# Altium schematic sheet nRF 52840.SchDoc
size A; DocumentNumber: 1; SheetNumber: 1; SheetTotal: 3
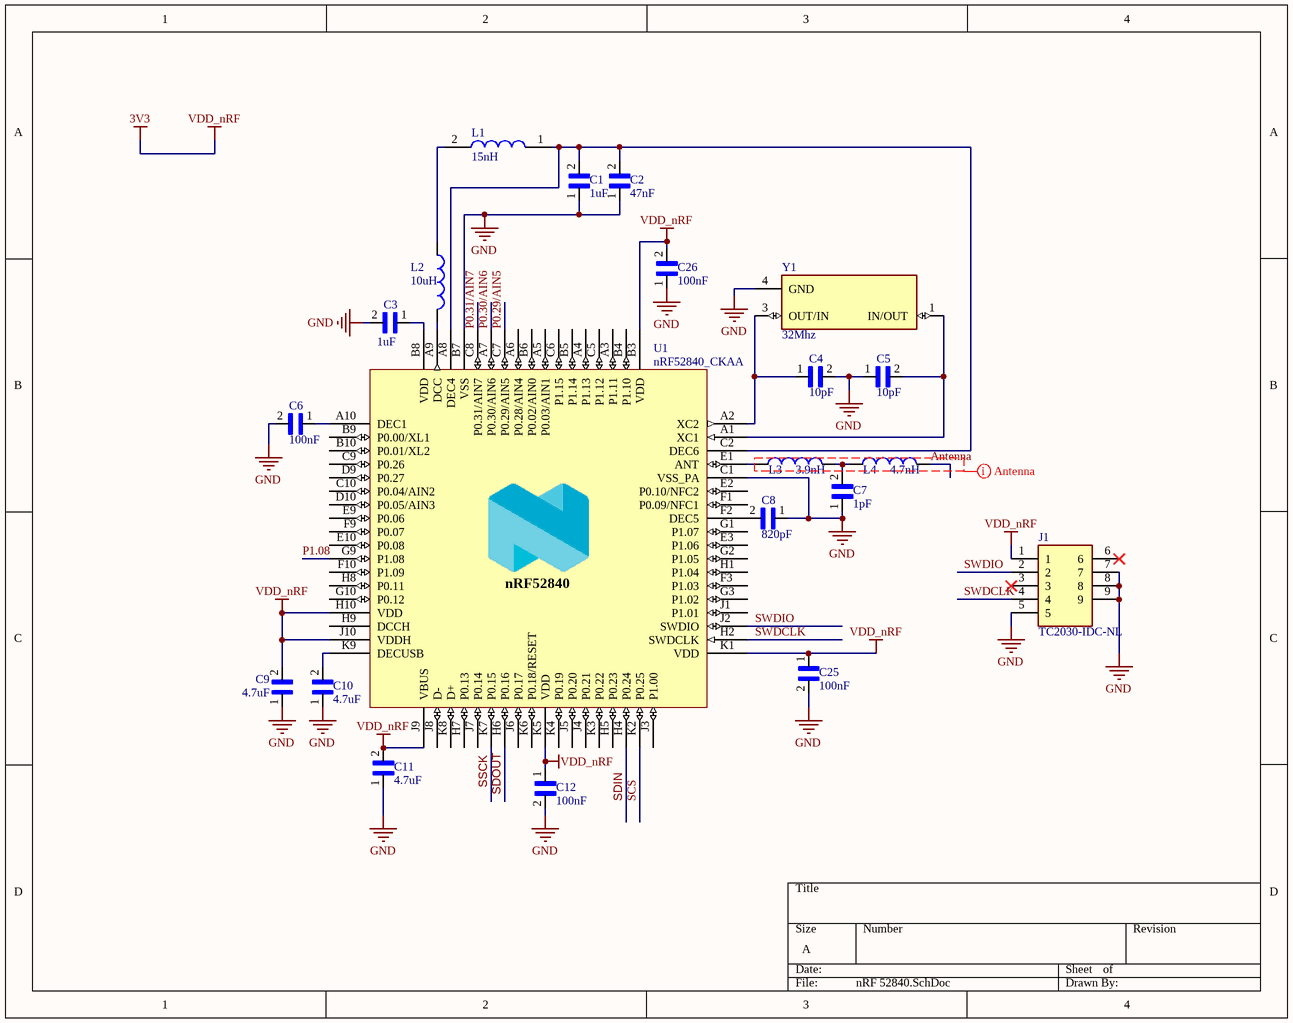
[diagram p0: nRF 52840.SchDoc]

## Parts
C1  1uF  [CAPC1608X90N]
C2  47nF  [CAPC0603X33N]
C3  1uF  [CAPC1608X90N]
C4  10pF  [CAPC0603X33N]
C5  10pF  [CAPC0603X33N]
C6  100nF  [CAPC1608X90N]
C7  1pF  [CAPC0603X33N]
C8  820pF  [CAPC0603X33N]
C9  4.7uF  [CAPC1608X95N]
C10  4.7uF  [CAPC1608X95N]
C11  4.7uF  [CAPC1608X95N]
C12  100nF  [CAPC1005X55N]
C25  100nF  [CAPC1005X55N]
C26  100nF  [CAPC1005X55N]
J1  TC2030-IDC-NL  [TC2030IDCNL]  (no BOM)
L1  15nH  [LQG15WH0N7B02D]
L2  10uH  [INDC1608X100N]
L3  3.9nH  [INDC0603X33N]
L4  4.7nH  [INDC0603X33N]
U1  nRF52840_CKAA  [BGA94C35P10X10_352X356X50]
Y1  32Mhz  [XTAL_ECS-374-8-48-CKY-TR]

## Nets
3V3: C9.2 C11.2 C12.1 C25.1 C26.2 J1.1 U1.B3(VDD) U1.H10(VDD) U1.J9(VBUS) U1.J10(VDDH) U1.K1(VDD) U1.K5(VDD)  [also labelled VDD_nRF]
GND: C1.1 C2.1 C3.2 C4.2 C5.1 C6.2 C7.1 C8.1 C9.1 C10.1 C11.1 C12.2 C25.2 C26.1 J1.5 J1.7 J1.8 J1.9 U1.B7(VSS) U1.C1(VSS_PA) U1.C4(GND) U1.D3(GND) U1.D4(GND) U1.D5(GND) U1.D6(GND) U1.D7(GND) U1.D8(GND) U1.E4(GND) U1.E5(GND) U1.E6(GND) U1.E7(GND) U1.E8(GND) U1.F4(GND) U1.F5(GND) U1.F6(GND) U1.F7(GND) U1.F8(GND) U1.G4(GND) U1.G5(GND) U1.G6(GND) U1.G7(GND) U1.G8(GND) U1.K10(GND) Y1.4(GND)
Antenna: L4.2
P0.29/AIN5: U1.C7(P0.29/AIN5)
P0.30/AIN6: U1.A7(P0.30/AIN6)
P0.31/AIN7: U1.C8(P0.31/AIN7)
P1.08: U1.G9(P1.08)
SCS: U1.K2(P0.25)
SDIN: U1.H4(P0.24)
SDOUT: U1.H6(P0.16)
SSCK: U1.K7(P0.15)
SWDCLK: J1.4 U1.H2(SWDCLK)
SWDIO: J1.2 U1.J2(SWDIO)
NetC1_2: C1.2 C2.2 L1.1 U1.A8(DEC4) U1.C2(DEC6)
NetC3_1: C3.1 U1.B8(VDD)
NetC4_1: C4.1 U1.A2(XC2) Y1.3(OUT/IN)
NetC5_2: C5.2 U1.A1(XC1) Y1.1(IN/OUT)
NetC6_1: C6.1 U1.A10(DEC1)
NetC7_2: C7.2 L3.2 L4.1
NetC8_2: C8.2 U1.F2(DEC5)
NetC10_2: C10.2 U1.K9(DECUSB)
NetL1_2: L1.2 L2.1
NetL2_2: L2.2 U1.A9(DCC)
NetL3_1: L3.1 U1.E1(ANT)

Not connected (* = marked no-connect by the designer): J1 3* 6*; U1 A3(P1.11) A4(P1.13) A5(P0.03/AIN1) A6(P0.28/AIN4) B4(P1.10) B5(P1.14) B6(P0.02/AIN0) B9(P0.00/XL1) B10(P0.01/XL2) C5(P1.12) C6(P1.15) C9(P0.26) C10(P0.04/AIN2) D9(P0.27) D10(P0.05/AIN3) E2(P0.10/NFC2) E3(P1.06) E9(P0.06) E10(P0.08) F1(P0.09/NFC1) F3(P1.03) F9(P0.07) F10(P1.09) G1(P1.07) G2(P1.05) G3(P1.02) G10(P0.12) H1(P1.04) H5(P0.23) H7(P0.13) H8(P0.11) H9(DCCH) J1(P1.01) J3(P1.00) J4(P0.21) J5(P0.20) J6(P0.17) J7(P0.14) J8(D-) K3(P0.22) K4(P0.19) K6(P0.18/RESET) K8(D+)

## Layout directives
net class 2.4GhZ RF: Antenna

## Notes on the sheet
- (in symbol nRF52840_CKAA) nRF52840

## Library data of the parts
C1 C3 = C1608X7R1C105K080AC: TDK - C1608X7R1C105K080AC - SMD Multilayer Ceramic Capacitor, 1 µF, 16 V, 0603 [1608 Metric], ± 10%, X7R, C Series TDK; Voltage Rating: 16V; Supplier 1: Digi-Key; Manufacturer: TDK; Manufacturer Part Number: C1608X7R1C105K080AC; RoHS: Yes; Category: Ceramic Capacitors; Stock 1: 2663219; Pricing 1: 1=0.13000, 10=0.09600, 50=0.05440, 100=0.04500, 500=0.03156, 1000=0.02613 (USD); Mount: Surface Mount; Case/Package: 0603; Case Code (Metric): 1608; Case Code (Imperial): 0603; Dielectric Material: Ceramic; Weight: 7.1E-05oz; Min Operating Temperature: -55°C; Max Operating Temperature: 125°C; Capacitance: 1uF; Tolerance: 10%; Dielectric: X7R; Packaging: Tape and Reel; Package Quantity: 1; Voltage Rating (DC): 16V; Termination: SMD/SMT; Voltage: 16V; Series: C; Construction: Flat; Resistor Type: Ceramic; Length: 1.6mm; Width: 0.031inch; Height: 0.8mm; Depth: 0.8mm; Thickness: 0.037inch; Radiation Hardening: No; REACH SVHC: No SVHC; Lead Free: Lead Free; RoHS Compliant: Yes; ComponentLink1URL: https://datasheet.ciiva.com/11788/0900766b80c1bb00-11788075.pdf?src-supplier=RSComponents; ComponentLink1Description: https://datasheet.ciiva.com/11788/0900766b80c1bb00-11788075.pdf?src-supplier=RSComponents; ComponentLink2URL: https://datasheet.ciiva.com/22648/1796654-22648704.pdf?src-supplier=Element14; ComponentLink2Description: https://datasheet.ciiva.com/22648/1796654-22648704.pdf?src-supplier=Element14; ComponentLink3URL: https://datasheet.ciiva.com/26285/3025c1608x7r1c105k080ac-26285242.pdf?src-supplier=Onlinecomponents.com; ComponentLink3Description: https://datasheet.ciiva.com/26285/3025c1608x7r1c105k080ac-26285242.pdf?src-supplier=Onlinecomponents.com; ComponentLink4URL: https://datasheet.ciiva.com/15192/getdatasheetpartid-715881-15192029.pdf?src-supplier=Verical; ComponentLink4Description: https://datasheet.ciiva.com/15192/getdatasheetpartid-715881-15192029.pdf?src-supplier=Verical; ComponentLink5URL: https://datasheet.ciiva.com/17487/e412-c-17487343.pdf?src-supplier=Avnet+Europe; ComponentLink5Description: https://datasheet.ciiva.com/17487/e412-c-17487343.pdf?src-supplier=Avnet+Europe; ComponentLink6URL: https://datasheet.ciiva.com/22694/1796654-22694127.pdf?src-supplier=Element14; ComponentLink6Description: https://datasheet.ciiva.com/22694/1796654-22694127.pdf?src-supplier=Element14; ComponentLink7URL: https://datasheet.ciiva.com/6250/tdkmlcccaprange-6250871.pdf?src-supplier=Digi-Key; ComponentLink7Description: https://datasheet.ciiva.com/6250/tdkmlcccaprange-6250871.pdf?src-supplier=Digi-Key; ComponentLink8URL: https://datasheet.ciiva.com/16199/e412-c-16199815.pdf?src-supplier=Future+Electronics; ComponentLink8Description: https://datasheet.ciiva.com/16199/e412-c-16199815.pdf?src-supplier=Future+Electronics; ComponentLink9URL: https://datasheet.ciiva.com/6156/1571323-6156168.pdf?src-supplier=Farnell; ComponentLink9Description: https://datasheet.ciiva.com/6156/1571323-6156168.pdf?src-supplier=Farnell; ComponentLink10URL: https://datasheet.ciiva.com/48671/e412-c-48671305.pdf?src-supplier=Avnet; ComponentLink10Description: https://datasheet.ciiva.com/48671/e412-c-48671305.pdf?src-supplier=Avnet; ComponentLink11URL: https://datasheet.ciiva.com/22749/1744655-22749595.pdf?src-supplier=Element14; ComponentLink11Description: https://datasheet.ciiva.com/22749/1744655-22749595.pdf?src-supplier=Element14
C2 = GRM033R61C473KE84D: 0201 47 nF 16 V ±10% Tolerance X5R SMT Multilayer Ceramic Capacitor; Manufacturer: Murata; Voltage Rating: 16V; Supplier 1: Digi-Key; Manufacturer Part Number: GRM033R61C473KE84D; RoHS: Yes; Category: Ceramic Capacitors; Stock 1: 123710; Pricing 1: 1=0.10000, 10=0.06800, 50=0.03720, 100=0.03040, 500=0.02174, 1000=0.01708, 2500=0.01552, 5000=0.01428 (USD); Mount: Surface Mount; Case/Package: 0201; Case Code (Metric): 0603; Case Code (Imperial): 0201; Weight: 1.2E-05oz; Min Operating Temperature: -55°C; Max Operating Temperature: 85°C; Package Quantity: 15000; Packaging: Tape and Reel; Capacitance: 47nF; Tolerance: 10%; Voltage Rating (DC): 16V; Dielectric: X5R; Termination: SMD/SMT; Length: 0.024inch; Width: 0.012inch; Height: 0.3mm; Thickness: 0.013inch; Lead Free: Lead Free; RoHS Compliant: Yes; ComponentLink1URL: https://datasheet.ciiva.com/18699/grm033r61c473ke84-01-18699268.pdf?src-supplier=Digi-Key; ComponentLink1Description: https://datasheet.ciiva.com/18699/grm033r61c473ke84-01-18699268.pdf?src-supplier=Digi-Key; ComponentLink2URL: https://datasheet.ciiva.com/18699/partnumbering-e-01-18699269.pdf?src-supplier=Digi-Key; ComponentLink2Description: https://datasheet.ciiva.com/18699/partnumbering-e-01-18699269.pdf?src-supplier=Digi-Key; ComponentLink3URL: https://datasheet.ciiva.com/24221/c02e-24221301.pdf?src-supplier=Mouser; ComponentLink3Description: https://datasheet.ciiva.com/24221/c02e-24221301.pdf?src-supplier=Mouser; ComponentLink4URL: https://datasheet.ciiva.com/18699/partnumbering-e-01-18699270.pdf?src-supplier=Digi-Key; ComponentLink4Description: https://datasheet.ciiva.com/18699/partnumbering-e-01-18699270.pdf?src-supplier=Digi-Key
C4 C5 = GRM0335C2A100JA01D: Cap Ceramic 10pF 100V C0G 5% Pad SMD 0201 125C T/R; Manufacturer: Murata; Supplier 1: Digi-Key; Manufacturer Part Number: GRM0335C2A100JA01D; RoHS: Yes; Category: Ceramic Capacitors; Stock 1: 52350; Pricing 1: 1=0.10000, 10=0.03200, 50=0.01720, 100=0.01410, 500=0.01006, 1000=0.00791, 2500=0.00719, 5000=0.00661 (USD); Mount: Surface Mount; Case/Package: 0201; Case Code (Metric): 0603; Case Code (Imperial): 0201; Weight: 1.2E-05oz; Min Operating Temperature: -55°C; Max Operating Temperature: 125°C; Package Quantity: 1; Packaging: Tape and Reel; Capacitance: 10pF; Tolerance: 5%; Voltage Rating: 100V; Voltage Rating (DC): 100V; Dielectric: C0G; Termination: SMD/SMT; Length: 0.024inch; Width: 0.012inch; Height: 0.3mm; Thickness: 0.013inch; RoHS Compliant: Yes; ComponentLink1URL: https://datasheet.ciiva.com/18699/partnumbering-e-01-18699375.pdf?src-supplier=Digi-Key; ComponentLink1Description: https://datasheet.ciiva.com/18699/partnumbering-e-01-18699375.pdf?src-supplier=Digi-Key; ComponentLink2URL: https://datasheet.ciiva.com/18699/partnumbering-e-01-18699374.pdf?src-supplier=Digi-Key; ComponentLink2Description: https://datasheet.ciiva.com/18699/partnumbering-e-01-18699374.pdf?src-supplier=Digi-Key; ComponentLink3URL: https://datasheet.ciiva.com/24221/c02e-24221150.pdf?src-supplier=Mouser; ComponentLink3Description: https://datasheet.ciiva.com/24221/c02e-24221150.pdf?src-supplier=Mouser
C6 = 06033G104ZAT2A: 0603 100 nF 25 V -20 / +80 % Tolerance Y5V SMT Multilayer Ceramic Capacitor; Manufacturer: Kyocera AVX; Tolerance: 80%; Voltage Rating (DC): 25V; Insulation Resistance: 100GR; Dissipation Factor: 7%; Supplier 1: Digi-Key; Manufacturer Part Number: 06033G104ZAT2A; RoHS: Yes; Category: Ceramic Capacitors; Stock 1: 1016354; Pricing 1: 1=0.10000, 10=0.03000, 50=0.01660, 100=0.01350, 500=0.00966, 1000=0.00759 (USD); Mount: Surface Mount,PCB; Case/Package: 0603; Number of Pins: 2; Case Code (Imperial): 0603; Case Code (Metric): 1608; Contact Plating: Tin,Matte; Case Code: 0603; Min Operating Temperature: -30°C; Max Operating Temperature: 85°C; Capacitance: 100nF; Dielectric: Y5V; Packaging: Tape and Reel; Package Quantity: 1; Termination: SMD/SMT; Voltage Rating: 25V; Voltage: 25V; Series: -; Construction: Flat; Length: 1.6mm; Width: 0.032inch; Height: 0.9mm; Thickness: 0.035inch; Depth: 0.81mm; Radiation Hardening: No; REACH SVHC: No SVHC; Lead Free: Lead Free; RoHS Compliant: Yes; ComponentLink1URL: https://datasheet.ciiva.com/1124/318409-1124608.pdf?src-supplier=Element14; ComponentLink1Description: https://datasheet.ciiva.com/1124/318409-1124608.pdf?src-supplier=Element14; ComponentLink2URL: https://datasheet.ciiva.com/11786/0900766b802d4699-11786267.pdf?src-supplier=RSComponents; ComponentLink2Description: https://datasheet.ciiva.com/11786/0900766b802d4699-11786267.pdf?src-supplier=RSComponents; ComponentLink3URL: https://datasheet.ciiva.com/2987/cy5v-2987766.pdf?src-supplier=Avnet; ComponentLink3Description: https://datasheet.ciiva.com/2987/cy5v-2987766.pdf?src-supplier=Avnet; ComponentLink4URL: https://datasheet.ciiva.com/11464/cy5v-11464567.pdf?src-supplier=Avnet; ComponentLink4Description: https://datasheet.ciiva.com/11464/cy5v-11464567.pdf?src-supplier=Avnet; ComponentLink5URL: https://datasheet.ciiva.com/16484/cy5v-16484423.pdf?src-supplier=Avnet+Asia; ComponentLink5Description: https://datasheet.ciiva.com/16484/cy5v-16484423.pdf?src-supplier=Avnet+Asia; ComponentLink6URL: https://datasheet.ciiva.com/14590/70001073-14590664.pdf?src-supplier=Allied+Electronics; ComponentLink6Description: https://datasheet.ciiva.com/14590/70001073-14590664.pdf?src-supplier=Allied+Electronics; ComponentLink7URL: https://datasheet.ciiva.com/203/cy5v-203689.pdf?src-supplier=Digi-Key; ComponentLink7Description: https://datasheet.ciiva.com/203/cy5v-203689.pdf?src-supplier=Digi-Key; ComponentLink8URL: https://datasheet.ciiva.com/203/cy5v-203690.pdf?src-supplier=Digi-Key; ComponentLink8Description: https://datasheet.ciiva.com/203/cy5v-203690.pdf?src-supplier=Digi-Key; ComponentLink9URL: https://datasheet.ciiva.com/203/cy5v-203691.pdf?src-supplier=Digi-Key; ComponentLink9Description: https://datasheet.ciiva.com/203/cy5v-203691.pdf?src-supplier=Digi-Key; ComponentLink10URL: https://datasheet.ciiva.com/28613/578190-28613276.pdf?src-supplier=Element14; ComponentLink10Description: https://datasheet.ciiva.com/28613/578190-28613276.pdf?src-supplier=Element14; ComponentLink11URL: https://datasheet.ciiva.com/1124/578190-1124654.pdf?src-supplier=Element14; ComponentLink11Description: https://datasheet.ciiva.com/1124/578190-1124654.pdf?src-supplier=Element14; ComponentLink12URL: https://datasheet.ciiva.com/1124/578190-1124655.pdf?src-supplier=Element14; ComponentLink12Description: https://datasheet.ciiva.com/1124/578190-1124655.pdf?src-supplier=Element14
C7 = GRM0335C1H1R0BA01D: 0201 1 pF 50 V ±0.1 pF Tolerance C0G SMT Multilayer Ceramic Capacitor; Manufacturer: Murata; Voltage Rating: 50V; Supplier 1: Digi-Key; Manufacturer Part Number: GRM0335C1H1R0BA01D; RoHS: Yes; Category: Ceramic Capacitors; Stock 1: 1332849; Pricing 1: 1=0.10000, 10=0.02000, 50=0.01100, 100=0.00900, 500=0.00644, 1000=0.00506, 2500=0.00460, 5000=0.00423 (USD); Mount: Surface Mount; Case/Package: 0201; Case Code (Metric): 0603; Case Code (Imperial): 0201; Min Operating Temperature: -55°C; Max Operating Temperature: 125°C; Packaging: Tape and Reel; Package Quantity: 15000; Capacitance: 1pF; Dielectric: C0G; Termination: SMD/SMT; Voltage Rating (DC): 50V; Series: GRM; Length: 0.024inch; Width: 0.012inch; Thickness: 0.013inch; Depth: 0.3mm; Lead Free: Lead Free; RoHS Compliant: Yes; ComponentLink1URL: https://datasheet.ciiva.com/29538/partnumbering-e-01-29538566.pdf?src-supplier=Digi-Key; ComponentLink1Description: https://datasheet.ciiva.com/29538/partnumbering-e-01-29538566.pdf?src-supplier=Digi-Key
C8 = GRM033R71E821KA01D: 0201 820 pF 25 V ±10% Tolerance X7R Multilayer Ceramic Capacitor; Manufacturer: Murata; Voltage Rating: 25V; Supplier 1: Digi-Key; Manufacturer Part Number: GRM033R71E821KA01D; RoHS: Yes; Category: Ceramic Capacitors; Stock 1: 127531; Pricing 1: 1=0.10000, 10=0.02700, 50=0.01440, 100=0.01180, 500=0.00846, 1000=0.00664, 2500=0.00604, 5000=0.00555 (USD); Mount: Surface Mount; Case/Package: 0201; Case Code (Imperial): 0201; Case Code (Metric): 0603; Min Operating Temperature: -55°C; Max Operating Temperature: 125°C; Capacitance: 820pF; Tolerance: 10%; Dielectric: X7R; Packaging: Tape and Reel; Package Quantity: 1; Voltage Rating (DC): 25V; Termination: SMD/SMT; Voltage: 25V; Series: GRM; Construction: Flat; Length: 0.6mm; Width: 0.3mm; Height: 0.3mm; Thickness: 0.013inch; Depth: 0.3mm; Radiation Hardening: No; Lead Free: Lead Free; RoHS Compliant: Yes; ComponentLink1URL: https://datasheet.ciiva.com/5414/product-5414169.pdf?src-supplier=Mouser; ComponentLink1Description: https://datasheet.ciiva.com/5414/product-5414169.pdf?src-supplier=Mouser; ComponentLink2URL: https://datasheet.ciiva.com/130/partnumbering-e-01-130155.pdf?src-supplier=Digi-Key; ComponentLink2Description: https://datasheet.ciiva.com/130/partnumbering-e-01-130155.pdf?src-supplier=Digi-Key; ComponentLink3URL: https://datasheet.ciiva.com/11602/product-11602283.pdf?src-supplier=Avnet; ComponentLink3Description: https://datasheet.ciiva.com/11602/product-11602283.pdf?src-supplier=Avnet; ComponentLink4URL: https://datasheet.ciiva.com/130/partnumbering-e-01-130156.pdf?src-supplier=Digi-Key; ComponentLink4Description: https://datasheet.ciiva.com/130/partnumbering-e-01-130156.pdf?src-supplier=Digi-Key; ComponentLink5URL: https://datasheet.ciiva.com/130/partnumbering-e-01-130157.pdf?src-supplier=Digi-Key; ComponentLink5Description: https://datasheet.ciiva.com/130/partnumbering-e-01-130157.pdf?src-supplier=Digi-Key; ComponentLink6URL: https://datasheet.ciiva.com/17453/product-17453309.pdf?src-supplier=Avnet+Europe; ComponentLink6Description: https://datasheet.ciiva.com/17453/product-17453309.pdf?src-supplier=Avnet+Europe
C9-C11 = GRM188C71A475KE11D: 0603 4.7 uF 10 V ±10% Tolerance X7S Multilayer Ceramic Capacitor; Manufacturer: Murata; Voltage Rating: 10V; Supplier 1: RSComponents; Manufacturer Part Number: GRM188C71A475KE11D; RoHS: Yes; Category: Ceramic Capacitors; Stock 1: 1; Pricing 1: 50=0.27400 (USD); Mount: Surface Mount; Case/Package: 0603; Case Code (Metric): 1608; Material: Ceramic; Case Code (Imperial): 0603; Weight: 0.000222oz; Min Operating Temperature: -55°C; Max Operating Temperature: 125°C; Tolerance: 10%; Dielectric: X7S; Capacitance: 4.7uF; Packaging: Tape and Reel; Termination: SMD/SMT; Resistor Type: Ceramic; Voltage Rating (DC): 10V; Package Quantity: 4000; Length: 1.6mm; Width: 0.8mm; Height: 0.8mm; Thickness: 0.037inch; RoHS Compliant: Yes; ComponentLink1URL: http://www.mouser.com/ds/2/281/c02e-2905.pdf?src-supplier=Mouser; ComponentLink1Description: http://www.mouser.com/ds/2/281/c02e-2905.pdf?src-supplier=Mouser; ComponentLink2URL: http://search.murata.co.jp/Ceramy/image/img/A01X/G101/ENG/GRM188C71A475KE11-01.pdf?src-supplier=Digi-Key; ComponentLink2Description: http://search.murata.co.jp/Ceramy/image/img/A01X/G101/ENG/GRM188C71A475KE11-01.pdf?src-supplier=Digi-Key
C12 C25 C26 = CL05A104KA5NNNC: Cap Ceramic 0.1uF 25V X5R 10% Pad SMD 0402 85¡ãC T/R / Multi Layer Ceramic Capacitor (MLCC); Manufacturer: Samsung; Supplier 1: Digi-Key; Manufacturer Part Number: CL05A104KA5NNNC; RoHS: Yes; Category: Ceramic Capacitors; Stock 1: 6603507; Pricing 1: 1=0.10000, 10=0.01100, 50=0.00620, 100=0.00510, 500=0.00362, 1000=0.00285, 2500=0.00259, 5000=0.00238 (USD); Mount: Surface Mount; Case/Package: 0402; Case Code (Imperial): 0402; Case Code (Metric): 1005; Min Operating Temperature: -55°C; Max Operating Temperature: 85°C; Capacitance: 100nF; Tolerance: 10%; Dielectric: X5R; Packaging: Tape and Reel; Package Quantity: 1; Voltage Rating: 25V; Voltage: 25V; Voltage Rating (DC): 25V; Length: 1mm; Width: 0.02inch; Height: 0.5mm; Thickness: 0.022inch; Depth: 0.5mm; Radiation Hardening: No; Lead Free: Lead Free; ComponentLink1URL: https://datasheet.ciiva.com/25802/cl05a104ka5nnnc-25802704.pdf?src-supplier=Digi-Key; ComponentLink1Description: https://datasheet.ciiva.com/25802/cl05a104ka5nnnc-25802704.pdf?src-supplier=Digi-Key; ComponentLink2URL: https://datasheet.ciiva.com/16437/cl05a104ka5nnnc-16437369.pdf?src-supplier=Future+Electronics; ComponentLink2Description: https://datasheet.ciiva.com/16437/cl05a104ka5nnnc-16437369.pdf?src-supplier=Future+Electronics; ComponentLink3URL: https://datasheet.ciiva.com/26838/getdatasheetpartid-357412-26838142.pdf?src-supplier=Verical; ComponentLink3Description: https://datasheet.ciiva.com/26838/getdatasheetpartid-357412-26838142.pdf?src-supplier=Verical; ComponentLink4URL: https://datasheet.ciiva.com/26309/mlcc-catalogdownload2013-eng-26309014.pdf?src-supplier=Distrelec; ComponentLink4Description: https://datasheet.ciiva.com/26309/mlcc-catalogdownload2013-eng-26309014.pdf?src-supplier=Distrelec
J1 = TC2030-IDC-NL: Connector; Manufacturer_Name: Tag Connect; Height: 18.669mm; Manufacturer_Part_Number: TC2030-IDC-NL
L1 = LQG15HN15NJ02D: Inductor RF Chip Multi-Layer 15nH 5% 100MHz 8Q-Factor Air 300mA 460mOhm DCR 0402 Paper T/R; Manufacturer: Murata; DC Resistance (DCR): 460mR; Q Factor: 8; Self Resonant Frequency: 2.3GHz; Shielding: Unshielded; Supplier 1: Digi-Key; Manufacturer Part Number: LQG15HN15NJ02D; RoHS: Yes; Category: Fixed Inductors; Stock 1: 62568; Pricing 1: 1=0.10000, 10=0.05500, 25=0.04920, 50=0.04180, 100=0.03690, 250=0.03380, 500=0.03072, 1000=0.02580, 2500=0.02211 (USD); Mount: Surface Mount; Case/Package: 0402; Core Material: Air; Case Code (Metric): 1005; Case Code (Imperial): 0402; Min Operating Temperature: -55°C; Max Operating Temperature: 125°C; Inductance: 15nH; Max DC Current: 300mA; Tolerance: 5%; Termination: SMD/SMT; Test Frequency: 100MHz; DC Current: 300mA; Packaging: Tape and Reel; Inductance Tolerance: 5%; Package Quantity: 1; Current Rating: 300mA; Length: 0.039inch; Width: 0.5mm; Height: 0.5mm; Height - Seated (Max): 0.022inch; Depth: 0.55mm; Radiation Hardening: No; Military Standard: Not; REACH SVHC: No SVHC; Lead Free: Lead Free; ComponentLink1URL: https://datasheet.ciiva.com/11801/0900766b80f10808-11801397.pdf?src-supplier=RSComponents; ComponentLink1Description: https://datasheet.ciiva.com/11801/0900766b80f10808-11801397.pdf?src-supplier=RSComponents; ComponentLink2URL: https://datasheet.ciiva.com/29696/l0075s0083lqg15hn-29696703.pdf?src-supplier=Digi-Key; ComponentLink2Description: https://datasheet.ciiva.com/29696/l0075s0083lqg15hn-29696703.pdf?src-supplier=Digi-Key; ComponentLink3URL: https://datasheet.ciiva.com/17277/l0075s0083lqg15hn-17277465.pdf?src-supplier=Avnet+Europe; ComponentLink3Description: https://datasheet.ciiva.com/17277/l0075s0083lqg15hn-17277465.pdf?src-supplier=Avnet+Europe; ComponentLink4URL: https://datasheet.ciiva.com/8002/66026-8002488.pdf?src-supplier=Element14; ComponentLink4Description: https://datasheet.ciiva.com/8002/66026-8002488.pdf?src-supplier=Element14; ComponentLink5URL: https://datasheet.ciiva.com/1063/l0075s0083lqg15hn-1063850.pdf?src-supplier=Digi-Key; ComponentLink5Description: https://datasheet.ciiva.com/1063/l0075s0083lqg15hn-1063850.pdf?src-supplier=Digi-Key; ComponentLink6URL: https://datasheet.ciiva.com/29696/l0075s0083lqg15hn-29696702.pdf?src-supplier=Digi-Key; ComponentLink6Description: https://datasheet.ciiva.com/29696/l0075s0083lqg15hn-29696702.pdf?src-supplier=Digi-Key
L2 = LBMF1608T100K: Inductor Chip Wirewound 10uH 10% 2.52MHz Ferrite 80mA 468mOhm DCR 0603 T/R; Manufacturer: Taiyo Yuden; Self Resonant Frequency: 32MHz; Shielding: Unshielded; DC Resistance (DCR): 360mR; Supplier 1: Digi-Key; Manufacturer Part Number: LBMF1608T100K; RoHS: Yes; Category: Fixed Inductors; Stock 1: 5221; Pricing 1: 1=0.25000, 10=0.22300, 25=0.19800, 50=0.16840, 100=0.14850, 250=0.13612, 500=0.12376, 1000=0.10395 (USD); Mount: Surface Mount; Case/Package: 0603; Core Material: Ferrite; Case Code (Metric): 1608; Case Code (Imperial): 0603; Weight: 7.1E-05oz; Min Operating Temperature: -40°C; Max Operating Temperature: 105°C; Packaging: Tape and Reel; Inductance: 10uH; Test Frequency: 2.52MHz; Max DC Current: 80mA; Termination: SMD/SMT; Package Quantity: 3000; Current Rating: 80mA; DC Current: 80mA; Tolerance: 10%; Series: LB; Inductance Tolerance: 10%; Resistor Type: Wirewound; Length: 0.063inch; Width: 0.031inch; Height: 0.35mm; Height - Seated (Max): 0.039inch; Depth: 0.9mm; Lead Pitch: 0.7mm; Radiation Hardening: No; Lead Free: Lead Free; Military Standard: Not; REACH SVHC: Unknown; Halogen Free: Halogen Free; RoHS Compliant: Yes; ComponentLink1URL: https://datasheet.ciiva.com/8504/lbmf1608t100k-ss-8504740.pdf?src-supplier=Avnet; ComponentLink1Description: https://datasheet.ciiva.com/8504/lbmf1608t100k-ss-8504740.pdf?src-supplier=Avnet; ComponentLink2URL: https://datasheet.ciiva.com/26872/getdatasheetpartid-637440-26872437.pdf?src-supplier=Verical; ComponentLink2Description: https://datasheet.ciiva.com/26872/getdatasheetpartid-637440-26872437.pdf?src-supplier=Verical; ComponentLink3URL: https://datasheet.ciiva.com/1040/lbmf1608t100k-ss-1040360.pdf?src-supplier=Digi-Key; ComponentLink3Description: https://datasheet.ciiva.com/1040/lbmf1608t100k-ss-1040360.pdf?src-supplier=Digi-Key; ComponentLink4URL: https://datasheet.ciiva.com/15986/610lbmf1608t100k-15986589.pdf?src-supplier=Onlinecomponents.com; ComponentLink4Description: https://datasheet.ciiva.com/15986/610lbmf1608t100k-15986589.pdf?src-supplier=Onlinecomponents.com; ComponentLink5URL: https://datasheet.ciiva.com/46395/1497259-46395174.pdf?src-supplier=Element14; ComponentLink5Description: https://datasheet.ciiva.com/46395/1497259-46395174.pdf?src-supplier=Element14
L3 = LQP03TN3N9B02D: Inductor RF Chip Thin Film 3.9nH 0.1nH 500MHz 14Q-Factor 400mA 300mOhm DCR 0201 Paper T/R; Manufacturer: Murata; Core Material: Non-Magnetic; DC Resistance (DCR): 300mR; Shielding: Unshielded; Tolerance: 3%; Self Resonant Frequency: 5.7GHz; Current: 250mA; Q Factor: 14; Supplier 1: Digi-Key; Manufacturer Part Number: LQP03TN3N9B02D; RoHS: Yes; Category: Fixed Inductors; Stock 1: 117865; Pricing 1: 1=0.10000, 10=0.04700, 25=0.04240, 50=0.03780, 100=0.03210, 250=0.02836, 500=0.02598, 1000=0.02221, 2500=0.01984 (USD); Mount: Surface Mount; Case/Package: 0201; Case Code (Imperial): 0201; Case Code (Metric): 0603; Min Operating Temperature: -55°C; Max Operating Temperature: 125°C; Inductance: 3.9nH; Max DC Current: 400mA; Package Quantity: 15000; Current Rating: 400mA; Packaging: Tape and Reel; Test Frequency: 500MHz; Resistor Type: Thin Film; Termination: SMD/SMT; DC Current: 400mA; Length: 0.6mm; Width: 0.012inch; Height: 0.3mm; Height - Seated (Max): 0.013inch; Depth: 0.33mm; Radiation Hardening: No; Lead Free: Lead Free; Military Standard: Not; REACH SVHC: No SVHC; ComponentLink1URL: https://datasheet.ciiva.com/16444/l0075s0084lqp03tn-02-16444482.pdf?src-supplier=Future+Electronics; ComponentLink1Description: https://datasheet.ciiva.com/16444/l0075s0084lqp03tn-02-16444482.pdf?src-supplier=Future+Electronics
L4 = LQP03TN4N7H02D: Inductor RF Chip Thin Film 4.7nH 3% 500MHz 14Q-Factor 350mA 400mOhm DCR 0201 Paper T/R; Manufacturer: Murata; MF: {'manufacturer': u'Murata'}; Core Material: Non-Magnetic; DC Resistance (DCR): 400mR; Self Resonant Frequency: 4.4GHz; Shielding: Unshielded; Q Factor: 14; Availability: Unavailable; Price: None; Package: None; Value: *; Supplier 1: Digi-Key; Manufacturer Part Number: LQP03TN4N7H02D; RoHS: Yes; Category: Fixed Inductors; Stock 1: 240787; Pricing 1: 1=0.10000, 10=0.04700, 25=0.04240, 50=0.03780, 100=0.03210, 250=0.02836, 500=0.02598, 1000=0.02221, 2500=0.01984 (USD); Mount: Surface Mount; Case/Package: 0201; Case Code (Metric): 0603; Case Code (Imperial): 0201; Min Operating Temperature: -55°C; Max Operating Temperature: 125°C; Tolerance: 3%; Inductance: 4.7nH; Max DC Current: 350mA; Packaging: Tape and Reel; Package Quantity: 15000; Current Rating: 350mA; Termination: SMD/SMT; Resistor Type: Thin Film; Test Frequency: 500MHz; DC Current: 350mA; Series: LQP03TN_02; Technology: THIN FILM; Length: 0.024inch; Width: 0.3mm; Height: 0.3mm; Height - Seated (Max): 0.013inch; Depth: 0.33mm; Radiation Hardening: No; Military Standard: Not; Lead Free: Lead Free; RoHS Compliant: Yes; ComponentLink1URL: https://datasheet.ciiva.com/4982/s0084e-125392-4982064.pdf?src-supplier=Mouser; ComponentLink1Description: https://datasheet.ciiva.com/4982/s0084e-125392-4982064.pdf?src-supplier=Mouser; ComponentLink2URL: https://datasheet.ciiva.com/3865/lqp03tn4n7h0223-3865631.pdf?src-supplier=Arrow+Electronics; ComponentLink2Description: https://datasheet.ciiva.com/3865/lqp03tn4n7h0223-3865631.pdf?src-supplier=Arrow+Electronics; ComponentLink3URL: https://datasheet.ciiva.com/29698/s0084e-29698453.pdf?src-supplier=Digi-Key; ComponentLink3Description: https://datasheet.ciiva.com/29698/s0084e-29698453.pdf?src-supplier=Digi-Key; ComponentLink4URL: https://datasheet.ciiva.com/29698/s0084e-29698454.pdf?src-supplier=Digi-Key; ComponentLink4Description: https://datasheet.ciiva.com/29698/s0084e-29698454.pdf?src-supplier=Digi-Key
U1 = nRF52840_CKAA: Multi-protocol Bluetooth Low Energy, IEEE 802.15.4, ANT and 2.4GHz proprietary system-on-chip; Manufacturer: Nordic Semiconductor; Manufacturer Part Number: nRF52840-CKAAD0; Part Number: nRF52840-CKAAD0; LatestRevisionDate: 2018-12-17; Pin Count: 94; Publisher: Nordic Semiconductor; Published: 2018-12-17; Value: nRF52840_CKAA; Footprint Doc: WLCSP-94
Y1 = ECS-320-10-48-CKY-TR: Crystal 32MHz ±10ppm (Tol) ±10ppm (Stability) 10pF 100Ohm 4-Pin Ultra Mini-CSMD T/R; Manufacturer: ECS International; Supplier 1: Mouser; Manufacturer Part Number: ECS-320-10-48-CKY-TR; RoHS: Yes; Stock 1: 7614; Pricing 1: 1=1.27000, 10=1.20000, 50=1.20000, 100=1.03000, 500=0.99300, 1000=0.83700, 3000=0.82100, 10000=0.82100 (USD); ComponentLink1URL: https://www.ecsxtal.com/store/pdf/ECX-1048.pdf?src-supplier=Digi-Key; ComponentLink1Description: https://www.ecsxtal.com/store/pdf/ECX-1048.pdf?src-supplier=Digi-Key